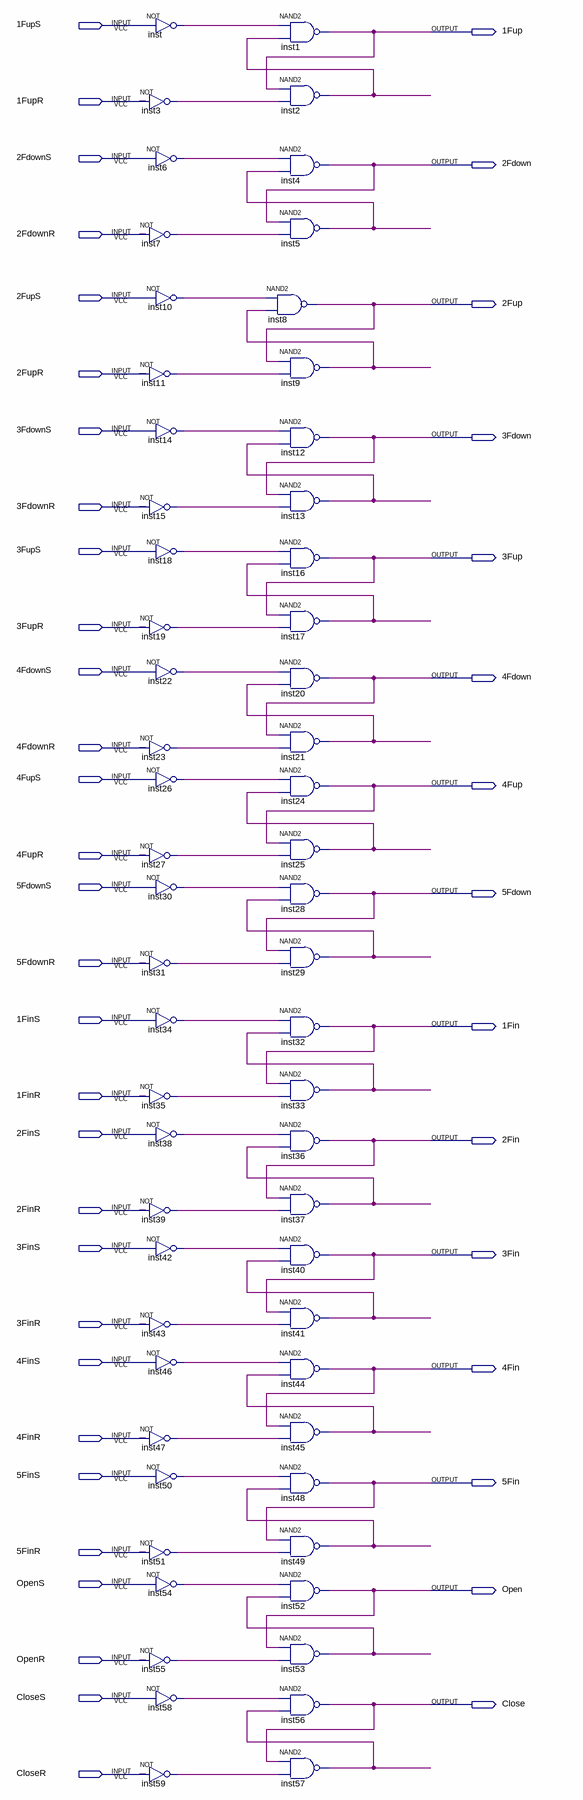
[diagram p0: schematic sheet]
// Quartus schematic storage.bdf as structural Verilog: 60 symbols, 45 pins
module storage (
  input  \1FupS ,
  input  \1FupR ,
  input  \2FdownS ,
  input  \2FdownR ,
  input  \2FupS ,
  input  \2FupR ,
  input  \3FdownS ,
  input  \3FdownR ,
  input  \3FupS ,
  input  \3FupR ,
  input  \4FdownS ,
  input  \4FdownR ,
  input  \4FupS ,
  input  \4FupR ,
  input  \5FdownS ,
  input  \5FdownR ,
  input  \1FinS ,
  input  \1FinR ,
  input  \2FinS ,
  input  \2FinR ,
  input  \3FinS ,
  input  \3FinR ,
  input  \4FinS ,
  input  \4FinR ,
  input  \5FinS ,
  input  \5FinR ,
  input  OpenS,
  input  OpenR,
  input  CloseS,
  input  CloseR,
  output \1Fup ,
  output \2Fdown ,
  output \2Fup ,
  output \3Fdown ,
  output \3Fup ,
  output \4Fdown ,
  output \4Fup ,
  output \5Fdown ,
  output \1Fin ,
  output \2Fin ,
  output \3Fin ,
  output \4Fin ,
  output \5Fin ,
  output Open,
  output Close
);

  wire inst2_out, inst3_out, inst5_out, inst6_out, inst7_out, inst9_out, inst10_out, inst11_out, inst13_out,
       inst14_out, inst15_out, inst17_out, inst18_out, inst19_out, inst21_out, inst22_out, inst23_out,
       inst25_out, inst26_out, inst27_out, inst29_out, inst30_out, inst31_out, inst33_out, inst34_out,
       inst35_out, inst37_out, inst38_out, inst39_out, inst41_out, inst42_out, inst43_out, inst45_out,
       inst46_out, inst47_out, inst49_out, inst50_out, inst51_out, inst53_out, inst54_out, inst55_out,
       inst57_out, inst58_out, inst59_out, inst_out;

  not inst (inst_out, \1FupS );
  not inst3 (inst3_out, \1FupR );
  not inst6 (inst6_out, \2FdownS );
  not inst7 (inst7_out, \2FdownR );
  not inst10 (inst10_out, \2FupS );
  not inst11 (inst11_out, \2FupR );
  not inst14 (inst14_out, \3FdownS );
  not inst15 (inst15_out, \3FdownR );
  not inst18 (inst18_out, \3FupS );
  not inst19 (inst19_out, \3FupR );
  not inst22 (inst22_out, \4FdownS );
  not inst23 (inst23_out, \4FdownR );
  not inst26 (inst26_out, \4FupS );
  not inst27 (inst27_out, \4FupR );
  not inst30 (inst30_out, \5FdownS );
  not inst31 (inst31_out, \5FdownR );
  not inst34 (inst34_out, \1FinS );
  not inst35 (inst35_out, \1FinR );
  not inst38 (inst38_out, \2FinS );
  not inst39 (inst39_out, \2FinR );
  not inst42 (inst42_out, \3FinS );
  not inst43 (inst43_out, \3FinR );
  not inst46 (inst46_out, \4FinS );
  not inst47 (inst47_out, \4FinR );
  not inst50 (inst50_out, \5FinS );
  not inst51 (inst51_out, \5FinR );
  not inst54 (inst54_out, OpenS);
  not inst55 (inst55_out, OpenR);
  not inst58 (inst58_out, CloseS);
  not inst59 (inst59_out, CloseR);
  nand inst1 (\1Fup , inst_out, inst2_out);
  nand inst2 (inst2_out, \1Fup , inst3_out);
  nand inst4 (\2Fdown , inst6_out, inst5_out);
  nand inst5 (inst5_out, \2Fdown , inst7_out);
  nand inst8 (\2Fup , inst10_out, inst9_out);
  nand inst9 (inst9_out, \2Fup , inst11_out);
  nand inst12 (\3Fdown , inst14_out, inst13_out);
  nand inst13 (inst13_out, \3Fdown , inst15_out);
  nand inst16 (\3Fup , inst18_out, inst17_out);
  nand inst17 (inst17_out, \3Fup , inst19_out);
  nand inst20 (\4Fdown , inst22_out, inst21_out);
  nand inst21 (inst21_out, \4Fdown , inst23_out);
  nand inst24 (\4Fup , inst26_out, inst25_out);
  nand inst25 (inst25_out, \4Fup , inst27_out);
  nand inst28 (\5Fdown , inst30_out, inst29_out);
  nand inst29 (inst29_out, \5Fdown , inst31_out);
  nand inst32 (\1Fin , inst34_out, inst33_out);
  nand inst33 (inst33_out, \1Fin , inst35_out);
  nand inst36 (\2Fin , inst38_out, inst37_out);
  nand inst37 (inst37_out, \2Fin , inst39_out);
  nand inst40 (\3Fin , inst42_out, inst41_out);
  nand inst41 (inst41_out, \3Fin , inst43_out);
  nand inst44 (\4Fin , inst46_out, inst45_out);
  nand inst45 (inst45_out, \4Fin , inst47_out);
  nand inst48 (\5Fin , inst50_out, inst49_out);
  nand inst49 (inst49_out, \5Fin , inst51_out);
  nand inst52 (Open, inst54_out, inst53_out);
  nand inst53 (inst53_out, Open, inst55_out);
  nand inst56 (Close, inst58_out, inst57_out);
  nand inst57 (inst57_out, Close, inst59_out);
endmodule
